# EAGLE design tca9406_breakout (EAGLE 6.5.0)
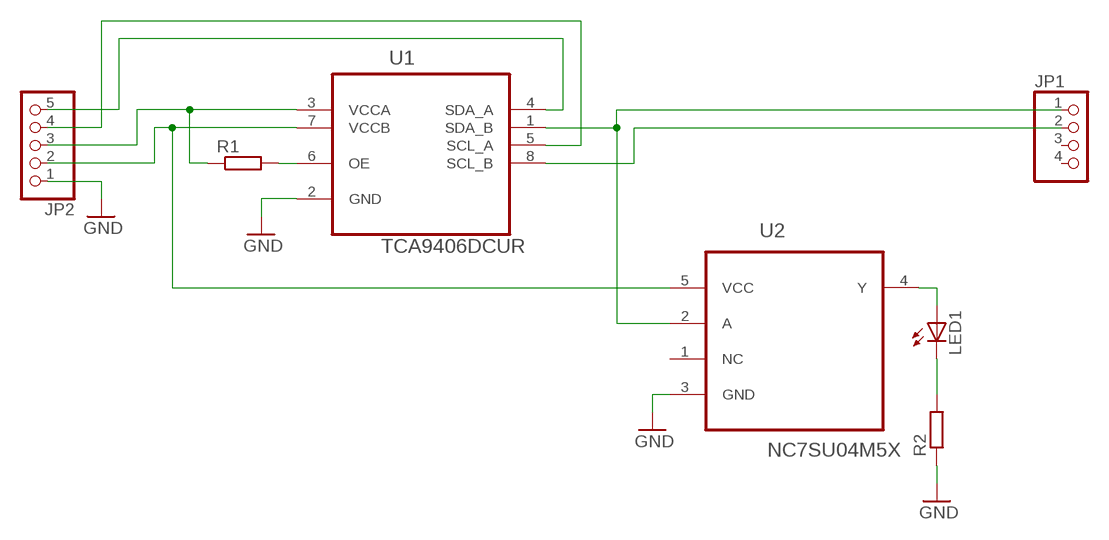
[diagram p0: schematic, sheet 1]

## Parts
JP1  PINHD-1X4  [1X04]
JP2  PINHD-1X5  [1X05]
LED1  LEDSML1206  [SML1206]
R1  R-EU_M1406  [M1406]
R2  R-EU_M1406  [M1406]
U1  TCA9406DCUR  [SOP50P310X90-8N]
U2  NC7SU04M5X  [SOT95P280X145-5N]

## Nets
GND: JP2.1 R2.1 U1.2(GND) U2.3(GND)
N$1: JP1.2 U1.8(SCL_B)
N$2: JP1.1 U1.1(SDA_B) U2.2(A)
N$3: JP2.5 U1.4(SDA_A)
N$4: JP2.4 U1.5(SCL_A)
N$5: JP2.3 R1.1 U1.3(VCCA)
N$6: JP2.2 U1.7(VCCB) U2.5(VCC)
N$7: LED1.A U2.4(Y)
N$8: R1.2 U1.6(OE)
N$9: LED1.C R2.2
Unconnected: JP1.3 JP1.4 U2.1(NC)

## Library data of the parts
JP1 = pinhead:PINHD-1X4: PIN HEADER
JP2 = pinhead:PINHD-1X5: PIN HEADER
LED1 = led:LED: LED OSRAM: - CHIPLED LG R971, LG N971, LY N971, LG Q971, LY Q971, LO R971, LY R971 LH N974, LH R974 LS Q976, LO Q976, LY Q976 LO Q996 - Hyper CHIPLED LW Q18S LB Q993, LB Q99A, LB R99A - SideLED LS A670, LO A670, LY A670, LG A670, LP A670 LB A673, LV A673, LT A673, LW A673 LH A674 LY A675 LS A676, LA A676, LO A676, LY A676, LW A676 LS A679, LY A679, LG A679 - Hyper Micro SIDELED® LS Y876, LA Y876, LO Y876, LY Y876 LT Y87S - SmartLED LW L88C, LW L88S LB L89C, LB L89S, LG L890 LS L89K, LO L89K, LY L89K LS L896, LA L896, LO L896, LY L896 - TOPLED LS T670, LO T670, LY T670, LG T670, LP T670 LSG T670, LSP T670, LSY T670, LOP T670, LYG T670 LG T671, LOG T671, LSG T671 LB T673, LV T673, LT T673, LW T673 LH T674 LS T676, LA T676, LO T676, LY T676, LB T676, LH T676, LSB T676, LW T676 LB T67C, LV T67C, LT T67C, LS T67K, LO T67K, LY T67K, LW E67C LS E67B, LA E67B, LO E67B, LY E67B, LB E67C, LV E67C, LT E67C LW T67C LS T679, LY T679, LG T679 LS T770, LO T770, LY T770, LG T770, LP T770 LB T773, LV T773, LT T773, LW T773 LH T774 LS E675, LA E675, LY E675, LS T675 LS T776, LA T776, LO T776, LY T776, LB T776 LHGB T686 LT T68C, LB T68C - Hyper Mini TOPLED® LB M676 - Mini TOPLED Santana® LG M470 LS M47K, LO M47K, LY M47K Source: http://www.osram.convergy.de LUXEON: - LUMILED® LXK2-PW12-R00, LXK2-PW12-S00, LXK2-PW14-U00, LXK2-PW14-V00 LXK2-PM12-R00, LXK2-PM12-S00, LXK2-PM14-U00 LXK2-PE12-Q00, LXK2-PE12-R00, LXK2-PE12-S00, LXK2-PE14-T00, LXK2-PE14-U00 LXK2-PB12-K00, LXK2-PB12-L00, LXK2-PB12-M00, LXK2-PB14-N00, LXK2-PB14-P00, LXK2-PB14-Q00 LXK2-PR12-L00, LXK2-PR12-M00, LXK2-PR14-Q00, LXK2-PR14-R00 LXK2-PD12-Q00, LXK2-PD12-R00, LXK2-PD12-S00 LXK2-PH12-R00, LXK2-PH12-S00 LXK2-PL12-P00, LXK2-PL12-Q00, LXK2-PL12-R00 Source: www.luxeon.com KINGBRIGHT: KA-3528ASYC Source: www.kingbright.com
R1 R2 = resistor:R-EU_: RESISTOR, European symbol
U1 = TI-TCA9406DCUR:TCA9406DCUR: 2-BIT BIDIRECTIONAL 1MHz, I2C BUS AND SMBUS VOLTAGE-LEVEL TRANSLATOR WITH 8kV HBM ESD,US8-8; MPN: TCA9406DCUR; OC_FARNELL: 1972385; OC_NEWARK: 86W6769; PACKAGE: US8-8; SUPPLIER: TEXAS INSTRUMENTS
U2 = NC7SU04:NC7SU04M5X: TinyLogic HS Unbuffered Inverter; MPN: NC7SU04M5X; OC_FARNELL: 1652012; OC_NEWARK: 38C7563; PACKAGE: SOT-23-5; SUPPLIER: Fairchild

## Board
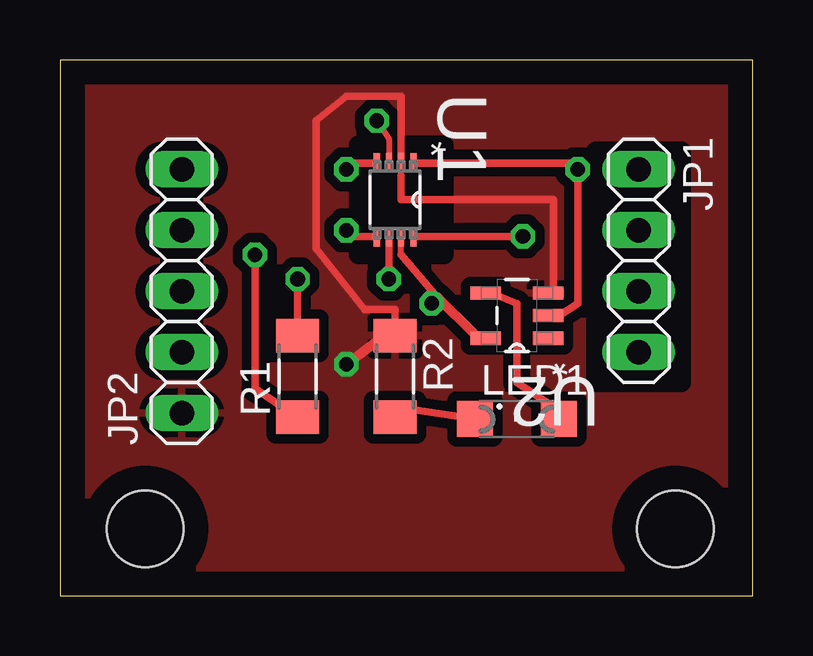
[diagram p1: board, top side]
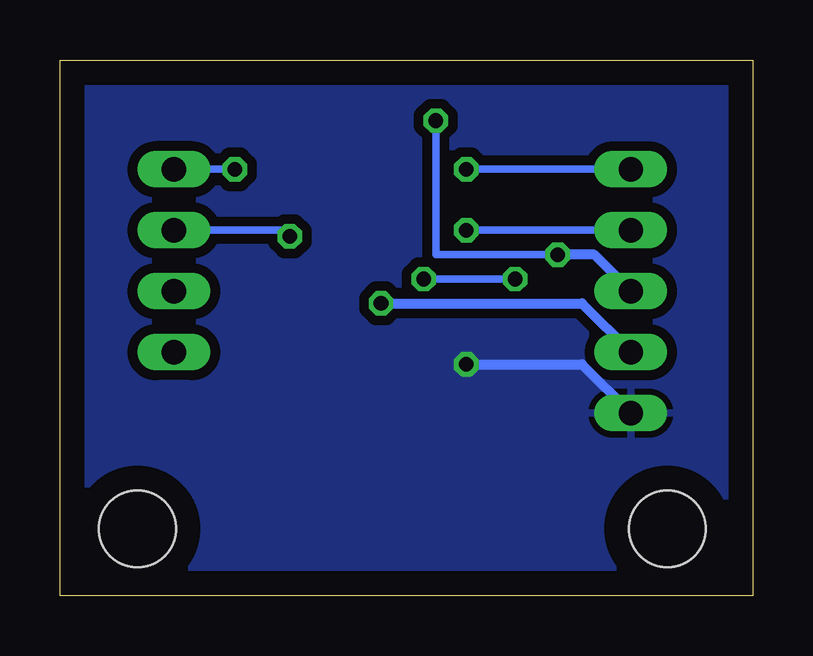
[diagram p2: board, bottom side, seen from below]

Size 28.88 x 22.34 mm. Coordinates in mm from the lower left corner, seen from the top.
Outline: 0,0 28.88,0 28.88,22.34 0,22.34 0,0
Copper layers (1*16): Top 0.035mm / dielectric 1.5mm / Bottom 0.035mm
Design rules "default": minimum track width 10mil, minimum drill 24mil, track to track 8mil, track to pad 8mil, pad to pad 8mil, via to via 8mil, smd to smd 8mil, copper to edge 40mil, drill to drill 8mil, minimum pad ring 10mil, minimum via ring 8mil, stop-mask expansion 4mil, vias tented up to drill 0mil, thermal gap 10mil
Holes 3.2 mm at 3.56,2.79 25.65,2.79
tRestrict: area 22.4,8.9 to 25.9,18.5; area 12.4,14.2 to 16,18.8

### Footprints (pad centres in the part's own frame; a part is rotated, then mirrored left to right if it is on the bottom)
1X04 = drill 1.016 long: 1 -3.81,0; 2 -1.27,0; 3 1.27,0; 4 3.81,0
1X05 = drill 1.016 long: 1 -5.08,0; 2 -2.54,0; 3 0,0; 4 2.54,0; 5 5.08,0
SML1206 = smd 1.5 x 1.5: A 1.75,0; C -1.75,0
M1406 = smd 1.4 x 1.8: 1 -1.7,0; 2 1.7,0
SOP50P310X90-8N = smd 0.711 x 0.254: 1 -1.6,0.762; 2 -1.6,0.254; 3 -1.6,-0.254; 4 -1.6,-0.762; 5 1.6,-0.762; 6 1.6,-0.254; 7 1.6,0.254; 8 1.6,0.762
SOT95P280X145-5N = smd 1.27 x 0.559: 1 -1.295,0.94; 2 -1.295,0; 3 -1.295,-0.94; 4 1.295,-0.94; 5 1.295,0.94

### Placement (x,y rotation side)
JP1  24.13,13.97 270 top
JP2  5.08,12.7 90 top
LED1  19.05,7.37 0 top
R1  9.91,9.14 90 top
R2  13.97,9.14 270 top
U1  13.97,16.51 270 top
U2  19.05,11.68 180 top

### Tracks (layer width: path | path; a pad name or v marks a point on that pad's centre or on a via)
GND  (via drill 0.61)
  Top 0.254: 14.22,17.53 U1.2 | 20.57,12.95 U2.3 | R2.1 13.97,11.18
  Top 0.305: 14.22,17.53 14.22,16.51 20.57,16.51 20.57,12.95 | U1.2 14.22,20.83 11.94,20.83 10.67,19.81 10.67,14.48 12.7,11.94 13.97,11.94 R2.1
  Top 0.406: 13.97,11.18 v11.94,9.65
  Bottom 0.406: JP2.1 7.11,9.65 v11.94,9.65
  pour Top (isolate 0.406): 0,22.35 0,0 28.96,0 28.96,22.35
  pour Bottom (isolate 0.406): 0,22.35 0,0 28.96,0 28.96,22.35
N$1  (via drill 0.61)
  Top 0.254: 14.73,14.99 U1.8
  Top 0.305: v19.3,14.99 14.73,14.99
  Bottom 0.305: v19.3,14.99 19.56,15.24 JP1.2
N$2  (via drill 0.61)
  Top 0.254: U2.2 20.83,11.68 | 14.73,18.03 U1.1
  Top 0.305: 14.73,18.03 21.34,18.03 v21.59,17.78 21.59,12.19 20.83,11.68
  Bottom 0.305: v21.59,17.78 JP1.1
N$3  (via drill 0.61)
  Top 0.254: 13.21,18.03 U1.4
  Top 0.305: 13.21,18.03 12.19,18.03 v11.94,17.78
  Bottom 0.305: JP2.5 v11.94,17.78
N$4  (via drill 0.61)
  Top 0.254: 13.21,14.99 U1.5
  Top 0.305: 13.21,14.99 12.19,14.99 v11.94,15.24
  Bottom 0.305: JP2.4 v11.94,15.24
N$5  (via drill 0.61)
  Top 0.254: v13.21,19.81 13.72,19.05 U1.3
  Top 0.305: v8.13,14.22 8.13,8.64 R1.1
  Bottom 0.305: v13.21,19.81 13.21,14.22 v8.13,14.22
  Bottom 0.406: v8.13,14.22 6.6,14.22 JP2.3
N$6  (via drill 0.61)
  Top 0.254: 14.22,14.22 U1.7 | 17.27,10.92 U2.5
  Top 0.305: 15.75,12.45 14.22,14.22
  Top 0.406: 17.27,10.92 15.75,12.45 v15.49,12.19
  Bottom 0.406: JP2.2 7.11,12.19 v15.49,12.19
N$7
  Top 0.254: 17.78,12.7 U2.4
  Top 0.305: 17.78,12.7 19.05,12.19 19.05,8.89 20.57,7.87 LED1.A
N$8  (via drill 0.61)
  Top 0.305: v13.72,13.21 U1.6 | R1.2 v9.91,13.21
  Bottom 0.305: v9.91,13.21 v13.72,13.21
N$9
  Top 0.254: R2.2 13.97,7.87
  Top 0.305: 13.97,7.87 LED1.C

### Text on the board
tDocu: I2C voltage level conversion module | SDA | SDA | SCL | SCL | 3V3 | 5V | GND | I2C ACT